# EAGLE design gpio4 (EAGLE 7.2.0)
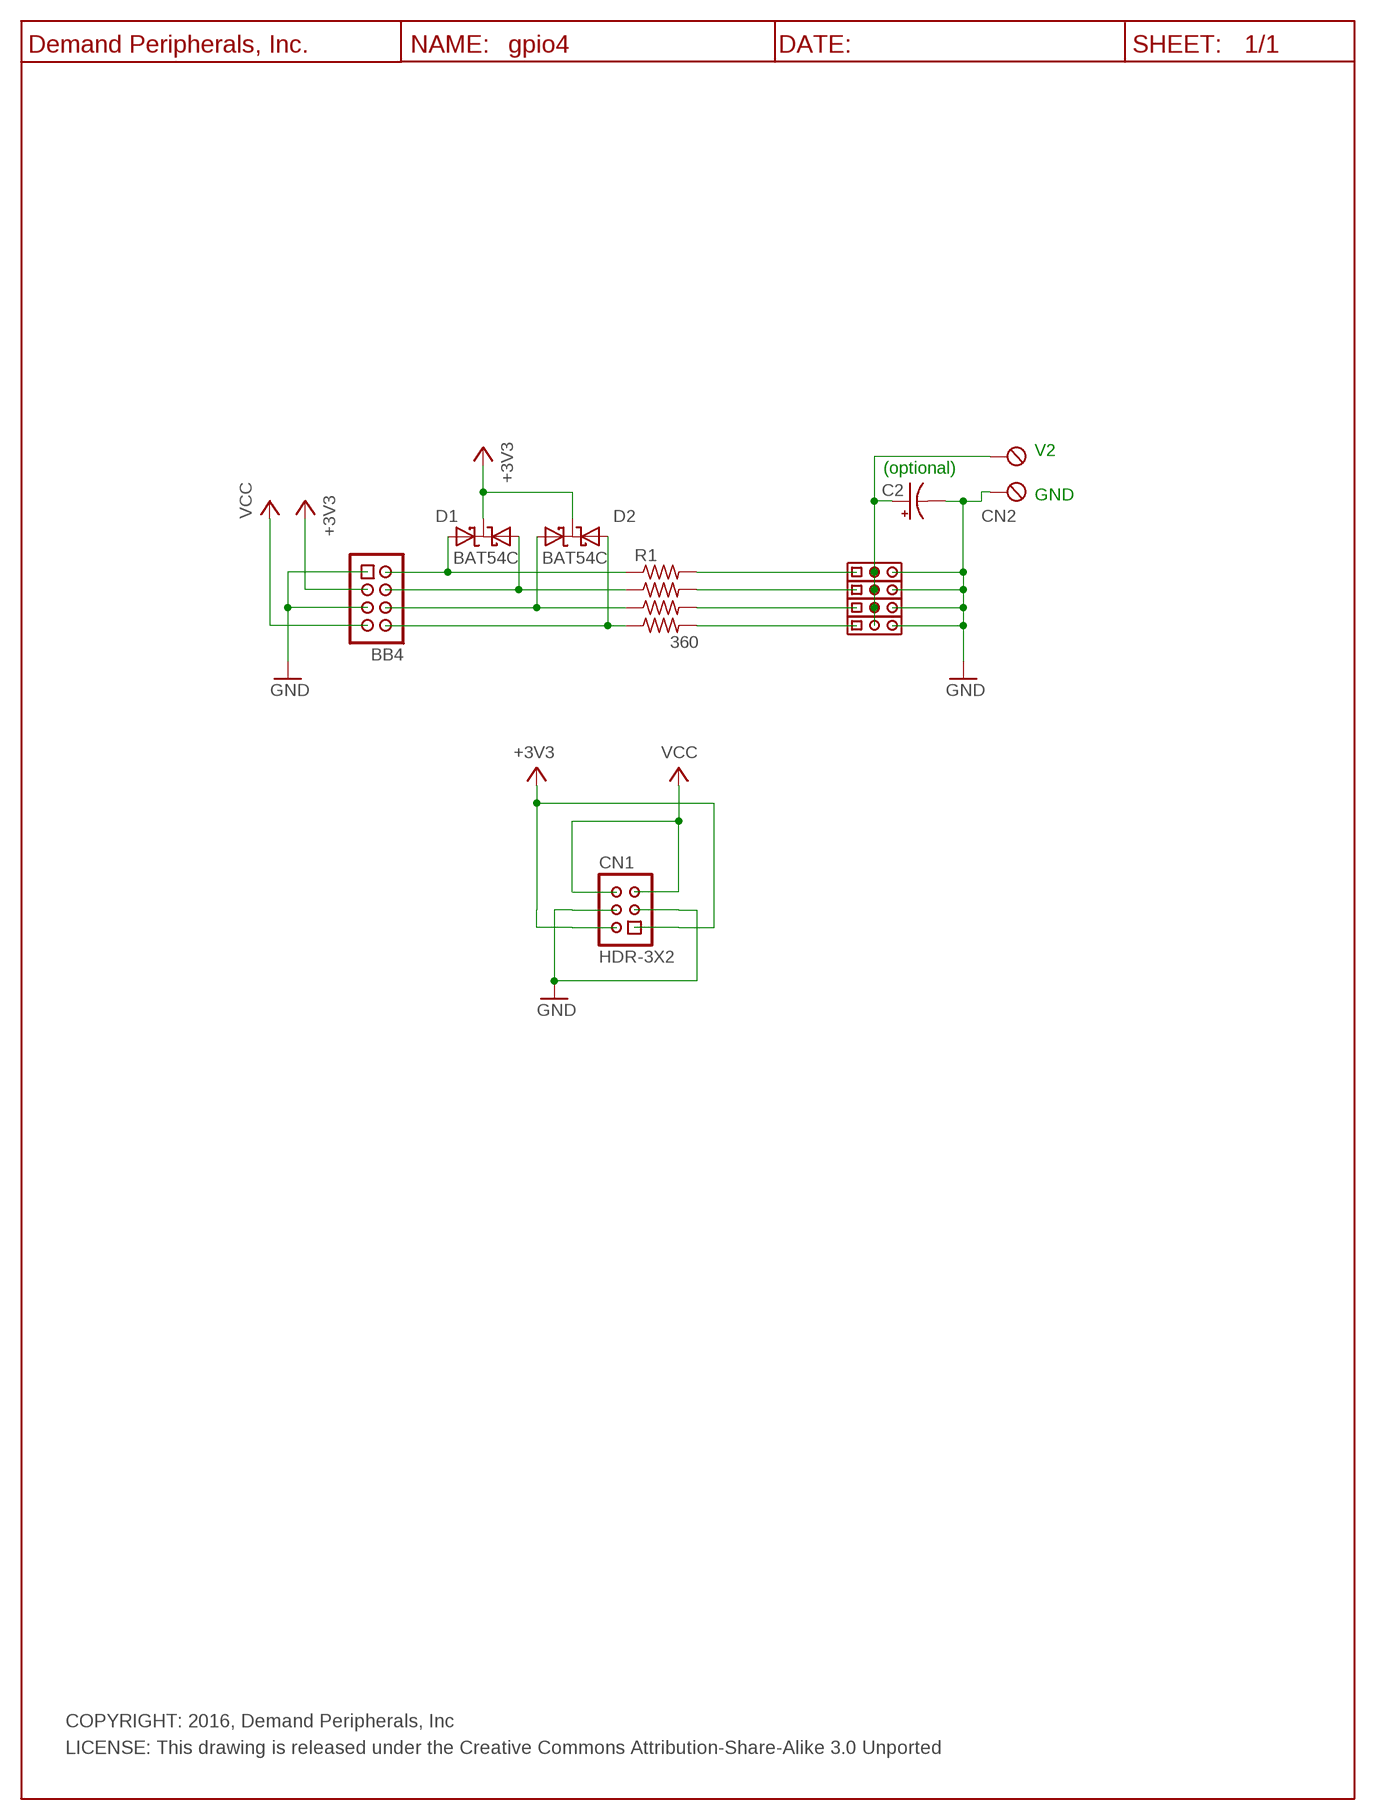
[diagram p0: schematic, sheet 1]

## Parts
BB4  BB_CON  HDR-4X2-SHR  [HDR-4X2]
C2  100uF  C100UF_E3.5-8  [E3.5-8]
CN1  HDR-3X2  [HDR-3X2]
CN2  TBLK-5.08-X2  [TBLK-5.08-X2]
D1  BAT54C  [SOT23]
D2  BAT54C  [SOT23]
R1  360  R360_R0603  [R0603]
R2  360  R360_R0603  [R0603]
R3  360  R360_R0603  [R0603]
R4  360  R360_R0603  [R0603]
U$1  DP_FRAME_P  [P_FRAME]
U$5  HDR-3X1  [HDR-3X1]
U$6  HDR-3X1  [HDR-3X1]
U$7  HDR-3X1  [HDR-3X1]
U$9  HDR-3X1  [HDR-3X1]

## Nets
+3V3: BB4.3 CN1.1 CN1.2 D1.3(CC) D2.3(CC)
GND: BB4.1 BB4.5 C2.- CN1.3 CN1.4 CN2.1(KL) U$5.3 U$6.3 U$7.3 U$9.3
N$1: R1.2 U$5.1
N$2: R2.2 U$6.1
N$3: R3.2 U$7.1
N$4: R4.2 U$9.1
N$11: BB4.2 D1.1(A1) R1.1
N$12: BB4.4 D1.2(A) R2.1
N$14: BB4.6 D2.1(A1) R3.1
N$15: BB4.8 D2.2(A) R4.1
N$18: C2.+ CN2.2(KL1) U$5.2 U$6.2 U$7.2 U$9.2
VCC: BB4.7 CN1.5 CN1.6

## Notes on the sheet
- V2
- (optional)
- GND
- COPYRIGHT: 2016, Demand Peripherals, Inc
- LICENSE: This drawing is released under the Creative Commons Attribution-Share-Alike 3.0 Unported

## Library data of the parts
BB4 = dpi-conn:HDR-4X2-SHR: Shrouded 4x2 pin header; VENDOR: Digikey; VENDOR-PART-NUM: 609-3530-ND
C2 = dpi-passive:C100UF_: 100uF polarized capacitor, general purpose; VENDOR: Digikey; VENDOR-PART-NUM: 1572-1044-ND
CN1 = dpi-conn:HDR-3X2: Unshrouded 3x2 header with 0.1 inch pitch; VENDOR: Digikey; VENDOR-PART-NUM: 952-2120-ND
CN2 = dpi-conn:TBLK-5.08-X2: Terminal Block, 5.08mm, x2, screw terminals; VENDOR: Digikey; VENDOR-PART-NUM: ED2609-ND
D1 D2 = dpi-diopto:BAT54C: BAT54C Dual Common Cathode Schottky; VENDOR: Digikey; VENDOR-PART-NUM: DB3X313N0LCT-ND
R1-R4 = dpi-passive:R360_: 360 Ohm resistor, 1%, 0.1 watt; VENDOR: Digikey; VENDOR-PART-NUM: 311-360HRTR-ND
U$1 = dpi-sym:DP_FRAME_P: Portrait/Letter Document Frame
U$5-U$7 U$9 = dpi-conn:HDR-3X1: 3 pin header on 0.1 inch centers, no shroud, no lock; VENDOR: Digikey; VENDOR-PART-NUM: 952-2264-ND

## Board
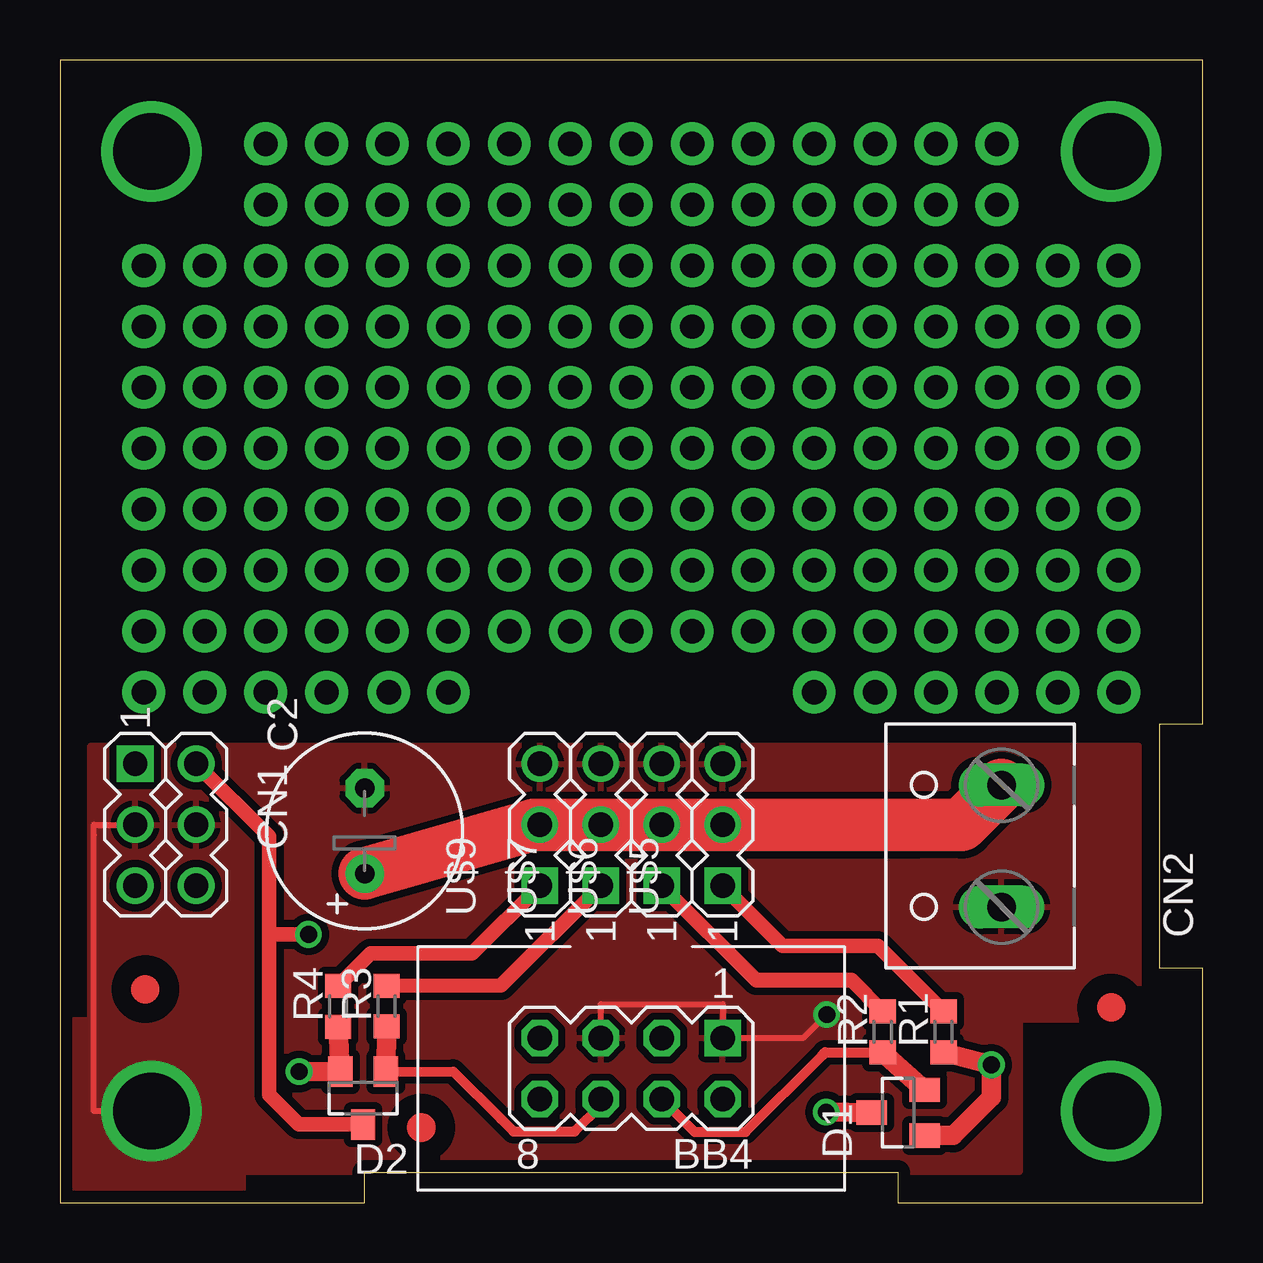
[diagram p1: board, top side]
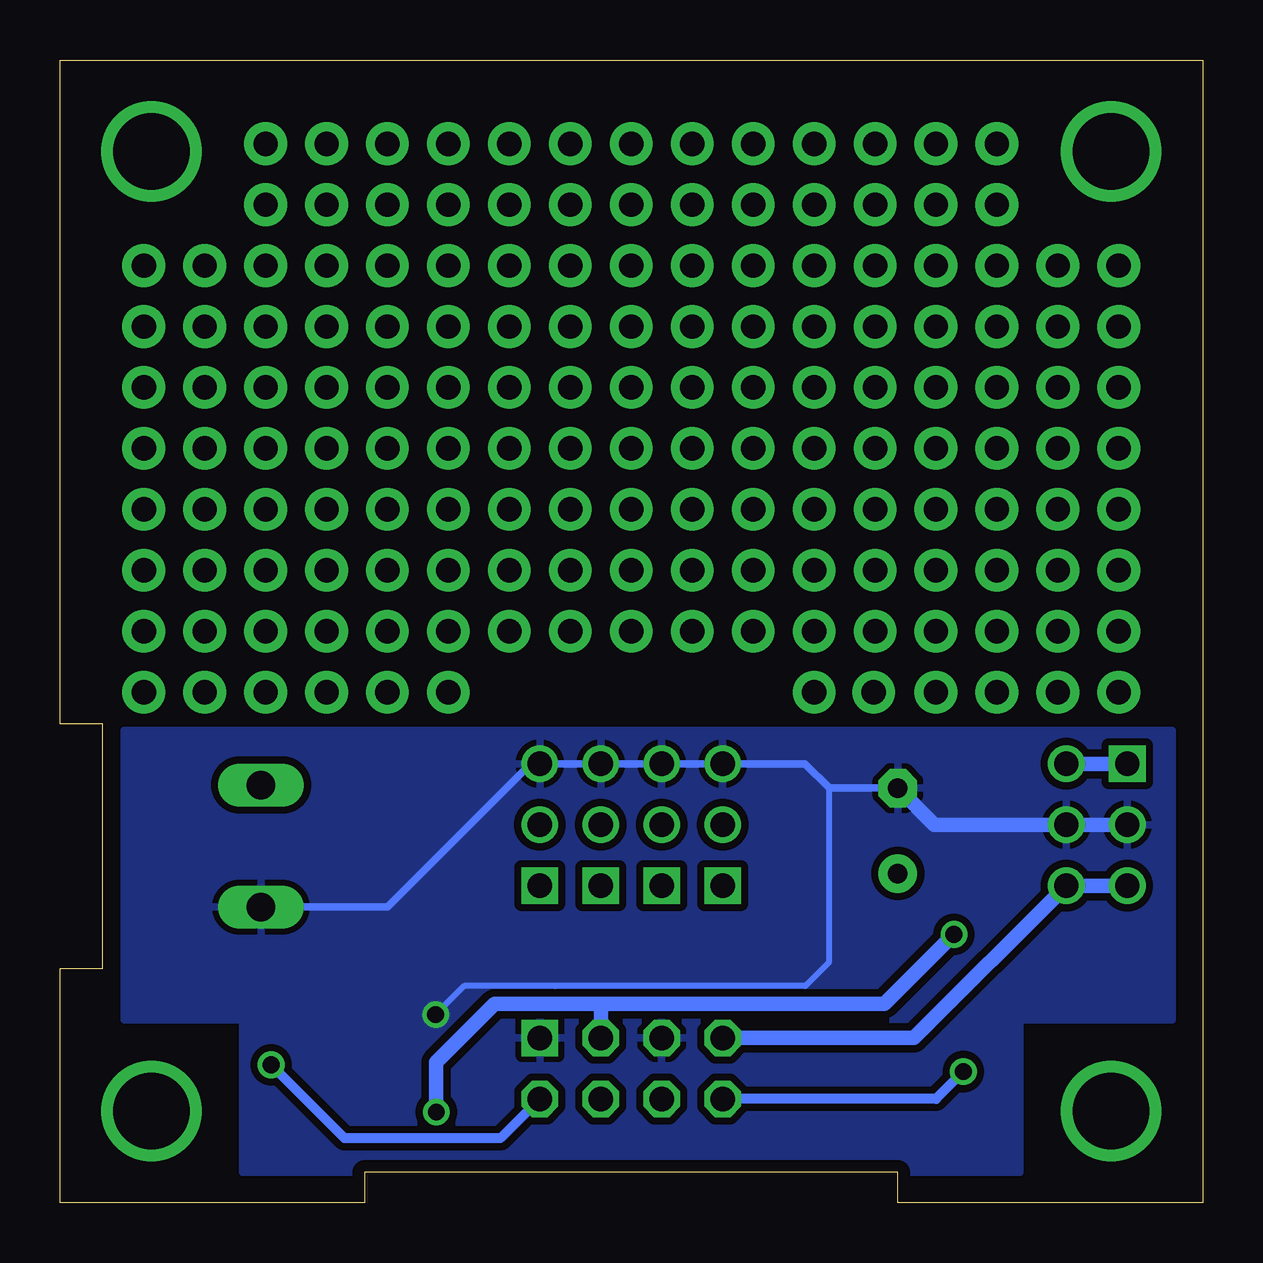
[diagram p2: board, bottom side, seen from below]

Size 47.62 x 47.62 mm. Coordinates in mm from the lower left corner, seen from the top.
Outline: 0,0 12.7,0 12.7,1.27 34.92,1.27 34.92,0 47.62,0 47.62,9.77 45.85,9.77 45.85,19.94 47.62,19.94 47.62,47.62 0,47.62 0,0
Copper layers (1*16): Top 0.035mm / dielectric 1.5mm / Bottom 0.035mm
Design rules "default *": minimum track width 10mil, minimum drill 20mil, track to track 12mil, track to pad 12mil, pad to pad 12mil, via to via 12mil, smd to smd 12mil, copper to edge 20mil, drill to drill 8mil, minimum pad ring 10mil, minimum via ring 8mil, stop-mask expansion 4mil, vias tented up to drill 0mil, thermal gap 10mil
tKeepout: area 15.1,1 to 32.5,9.7

### Footprints (pad centres in the part's own frame; a part is rotated, then mirrored left to right if it is on the bottom)
HDR-4X2 = drill 1.016 square: 1 -3.81,-1.27 | drill 1.016 octagon: 2 -3.81,1.27; 3 -1.27,-1.27; 4 -1.27,1.27; 5 1.27,-1.27; 6 1.27,1.27; 7 3.81,-1.27; 8 3.81,1.27
E3.5-8 = drill 0.813 pad 1.6: + -1.778,0 | drill 0.813 pad 1.6 octagon: - 1.778,0
HDR-3X2 = drill 1.016 square: 1 -2.54,-1.27 | drill 1.016: 2 -2.54,1.27; 3 0,-1.27; 4 0,1.27; 5 2.54,-1.27; 6 2.54,1.27
TBLK-5.08-X2 = drill 1.194 long: 1 -2.54,-0.127; 2 2.54,-0.127
SOT23 = smd 1.016 x 1.27: 1 -0.95,-1.1; 2 0.95,-1.1; 3 0,1.1
R0603 = smd 1 x 1.1: 1 -0.85,0; 2 0.85,0
HDR-3X1 = drill 1.016 square: 1 -2.54,0 | drill 1.016: 2 0,0; 3 2.54,0

### Placement (x,y rotation side)
BB4  23.81,5.59 180 top
C2  12.7,15.49 90 top
CN1  4.41,15.75 270 top
CN2  39.12,14.86 90 top
D1  34.94,3.75 90 top
D2  12.64,4.36 180 top
R1  36.83,7.11 90 top
R2  34.29,7.11 90 top
R3  13.61,8.19 90 top
R4  11.6,8.18 90 top
U$1  -2.54,-2.54 0 top
U$2  [FIDUCIAL]  15.06,3.12 0 top
U$3  [FIDUCIAL]  3.56,8.89 0 top
U$4  [DPI-2]  4.83,9.91 90 bottom
U$5  27.62,15.75 90 top
U$6  25.08,15.75 90 top
U$7  22.54,15.75 90 top
U$8  [FIDUCIAL]  43.81,8.13 0 top
U$9  20,15.75 90 top

### Tracks (layer width: path | path; a pad name or v marks a point on that pad's centre or on a via)
+3V3  (via drill 0.7)
  Top 0.61: D2.3 9.94,3.25 9.63,3.57 8.71,4.48 8.71,5.4 8.71,9.53 8.71,11.18 | 8.71,11.18 8.71,15.25 CN1.2 | 8.71,11.18 v10.36,11.18
  Top 0.813: v31.94,3.77 D1.3
  Bottom 0.61: CN1.2 CN1.1 | 25.34,8.28 13.26,8.28 13.2,8.34 v10.36,11.18 | 25.34,8.28 29.5,8.28 31.94,5.84 v31.94,3.77 | BB4.3 25.08,8.28 25.34,8.28
GND  (via drill 0.7, 3.17)
  Top 0.254: v3.81,3.81 1.41,3.81 1.41,15.3 1.41,15.75 CN1.3 | v31.97,7.84 30.99,6.86 BB4.1 27.64,6.86 27.64,8.27 22.54,8.27 BB4.5
  Bottom 0.254: 15.56,17.27 15.56,10.03 16.56,9.03 26.98,9.03 30.77,9.03 v31.97,7.84
  Bottom 0.305: C2.- 15.56,17.27 16.57,18.29 28,18.29 33.97,12.32 CN2.1
  Bottom 0.61: CN1.3 CN1.4 11.18,15.75 C2.-
  pour Bottom: 1.27,7.62 1.27,19.68 44.96,19.68 44.96,7.62 40.01,7.62 40.01,1.27 7.62,1.27 7.62,7.62
  pour Top: 1.27,19.05 44.96,19.05 44.96,7.62 40.01,7.62 40.01,1.27 7.62,1.27 7.62,0.51 0.51,0.51 0.51,7.62 1.27,7.62
MOUNT2  (via drill 3.17)
  other vias: 43.81,43.81
MOUNT3  (via drill 3.17)
  other vias: 43.81,3.81
MOUNT4  (via drill 3.17)
  other vias: 3.81,43.81
N$1
  Top 0.61: U$5.1 30.12,10.71 34.09,10.71 R1.2
N$2
  Top 0.61: R2.2 32.98,9.27 29.02,9.27 U$6.1 29.03,9.26 32.84,9.26
N$3
  Top 0.61: R3.2 18.38,9.04 U$7.1
N$4
  Top 0.61: R4.2 12.95,10.39 16.18,10.39 17.18,10.39 U$9.1
N$5  (via drill 1.02 pad 1.78)
  other vias: 13.7,21.27
N$6  (via drill 1.02 pad 1.78)
  other vias: 16.19,21.27
N$11  (via drill 0.7)
  Top 0.813: R1.1 v38.82,5.74 38.82,4.38 37.24,2.79 D1.1
  Bottom 0.406: BB4.2 29.26,2.68 35.05,2.68 35.76,2.68 v38.82,5.74
N$12
  Top 0.406: BB4.4 26.45,2.95 28.12,2.95 28.57,2.95 31.75,6.12 31.89,6.26 R2.1
  Top 0.813: R2.1 D1.2
N$14
  Top 0.406: D2.1 16.4,5.46 18.38,3.48 18.9,2.96 21.45,2.96 22.54,4.05 BB4.6
  Top 0.813: D2.1 R3.1
N$15  (via drill 0.7)
  Top 0.813: v9.97,5.46 D2.2 R4.1
  Bottom 0.406: v9.97,5.46 11.11,4.32 BB4.8
N$18
  Top 0.61: 19.75,15.75 U$9.2
  Top 2.184: C2.+ 19.75,15.75 | 19.75,15.75 35.61,15.73 | 35.61,15.73 35.69,15.73 | CN2.2 37.58,15.73 35.61,15.73 | 19.75,15.75 U$9.2 U$7.2 U$6.2 U$5.2
VCC
  Bottom 0.61: CN1.5 CN1.6 12.03,6.86 BB4.7
WW1  (via drill 1.02 pad 1.78)
  other vias: 36.51,23.81
WW2  (via drill 1.02 pad 1.78)
  other vias: 36.51,28.89
WW3  (via drill 1.02 pad 1.78)
  other vias: 3.49,26.35
WW4  (via drill 1.02 pad 1.78)
  other vias: 3.49,23.81
WW5  (via drill 1.02 pad 1.78)
  other vias: 3.49,28.89
WW6  (via drill 1.02 pad 1.78)
  other vias: 3.49,31.43
WW7  (via drill 1.02 pad 1.78)
  other vias: 3.49,33.97
WW8  (via drill 1.02 pad 1.78)
  other vias: 3.49,36.51
WW9  (via drill 1.02 pad 1.78)
  other vias: 3.49,39.05
WW10  (via drill 1.02 pad 1.78)
  other vias: 39.05,23.81
WW11  (via drill 1.02 pad 1.78)
  other vias: 39.05,28.89
WW12  (via drill 1.02 pad 1.78)
  other vias: 3.49,21.27
WW13  (via drill 1.02 pad 1.78)
  other vias: 6.03,26.35
WW14  (via drill 1.02 pad 1.78)
  other vias: 8.57,26.35
WW15  (via drill 1.02 pad 1.78)
  other vias: 11.11,26.35
WW16  (via drill 1.02 pad 1.78)
  other vias: 6.03,23.81
WW17  (via drill 1.02 pad 1.78)
  other vias: 6.03,28.89
WW18  (via drill 1.02 pad 1.78)
  other vias: 6.03,31.43
WW19  (via drill 1.02 pad 1.78)
  other vias: 6.03,33.97
WW20  (via drill 1.02 pad 1.78)
  other vias: 6.03,36.51
WW21  (via drill 1.02 pad 1.78)
  other vias: 6.03,39.05
WW22  (via drill 1.02 pad 1.78)
  other vias: 41.59,23.81
WW23  (via drill 1.02 pad 1.78)
  other vias: 41.59,28.89
WW24  (via drill 1.02 pad 1.78)
  other vias: 13.65,26.35
WW25  (via drill 1.02 pad 1.78)
  other vias: 16.19,26.35
WW26  (via drill 1.02 pad 1.78)
  other vias: 18.73,26.35
WW27  (via drill 1.02 pad 1.78)
  other vias: 21.27,26.35
WW28  (via drill 1.02 pad 1.78)
  other vias: 8.57,23.81
WW29  (via drill 1.02 pad 1.78)
  other vias: 8.57,28.89
WW30  (via drill 1.02 pad 1.78)
  other vias: 8.57,31.43
WW31  (via drill 1.02 pad 1.78)
  other vias: 8.57,33.97
WW32  (via drill 1.02 pad 1.78)
  other vias: 8.57,36.51
WW33  (via drill 1.02 pad 1.78)
  other vias: 8.57,39.05
WW34  (via drill 1.02 pad 1.78)
  other vias: 8.57,41.59
WW35  (via drill 1.02 pad 1.78)
  other vias: 8.57,44.13
WW36  (via drill 1.02 pad 1.78)
  other vias: 44.13,23.81
WW37  (via drill 1.02 pad 1.78)
  other vias: 23.81,26.35
WW38  (via drill 1.02 pad 1.78)
  other vias: 26.35,26.35
WW39  (via drill 1.02 pad 1.78)
  other vias: 28.89,26.35
WW40  (via drill 1.02 pad 1.78)
  other vias: 11.11,23.81
WW41  (via drill 1.02 pad 1.78)
  other vias: 11.11,28.89
WW42  (via drill 1.02 pad 1.78)
  other vias: 11.11,31.43
WW43  (via drill 1.02 pad 1.78)
  other vias: 11.11,33.97
WW44  (via drill 1.02 pad 1.78)
  other vias: 11.11,36.51
WW45  (via drill 1.02 pad 1.78)
  other vias: 11.11,39.05
WW46  (via drill 1.02 pad 1.78)
  other vias: 11.11,41.59
WW47  (via drill 1.02 pad 1.78)
  other vias: 11.11,44.13
WW48  (via drill 1.02 pad 1.78)
  other vias: 44.13,28.89
WW49  (via drill 1.02 pad 1.78)
  other vias: 31.43,26.35
WW50  (via drill 1.02 pad 1.78)
  other vias: 6.03,21.27
WW51  (via drill 1.02 pad 1.78)
  other vias: 33.97,26.35
WW52  (via drill 1.02 pad 1.78)
  other vias: 13.65,23.81
WW53  (via drill 1.02 pad 1.78)
  other vias: 13.65,28.89
WW54  (via drill 1.02 pad 1.78)
  other vias: 13.65,31.43
WW55  (via drill 1.02 pad 1.78)
  other vias: 13.65,33.97
WW56  (via drill 1.02 pad 1.78)
  other vias: 13.65,36.51
WW57  (via drill 1.02 pad 1.78)
  other vias: 13.65,39.05
WW58  (via drill 1.02 pad 1.78)
  other vias: 13.65,41.59
WW59  (via drill 1.02 pad 1.78)
  other vias: 13.65,44.13
WW60  (via drill 1.02 pad 1.78)
  other vias: 36.51,26.35
WW61  (via drill 1.02 pad 1.78)
  other vias: 8.57,21.27
WW62  (via drill 1.02 pad 1.78)
  other vias: 39.05,26.35
WW63  (via drill 1.02 pad 1.78)
  other vias: 41.59,26.35
WW64  (via drill 1.02 pad 1.78)
  other vias: 16.19,23.81
WW65  (via drill 1.02 pad 1.78)
  other vias: 16.19,28.89
WW66  (via drill 1.02 pad 1.78)
  other vias: 16.19,31.43
WW67  (via drill 1.02 pad 1.78)
  other vias: 16.19,33.97
WW68  (via drill 1.02 pad 1.78)
  other vias: 16.19,36.51
WW69  (via drill 1.02 pad 1.78)
  other vias: 16.19,39.05
WW70  (via drill 1.02 pad 1.78)
  other vias: 16.19,41.59
WW71  (via drill 1.02 pad 1.78)
  other vias: 16.19,44.13
WW72  (via drill 1.02 pad 1.78)
  other vias: 11.11,21.27
WW73  (via drill 1.02 pad 1.78)
  other vias: 44.13,26.35
WW76  (via drill 1.02 pad 1.78)
  other vias: 18.73,23.81
WW77  (via drill 1.02 pad 1.78)
  other vias: 18.73,28.89
WW78  (via drill 1.02 pad 1.78)
  other vias: 18.73,31.43
WW79  (via drill 1.02 pad 1.78)
  other vias: 18.73,33.97
WW80  (via drill 1.02 pad 1.78)
  other vias: 18.73,36.51
WW81  (via drill 1.02 pad 1.78)
  other vias: 18.73,39.05
WW82  (via drill 1.02 pad 1.78)
  other vias: 18.73,41.59
WW83  (via drill 1.02 pad 1.78)
  other vias: 18.73,44.13
WW88  (via drill 1.02 pad 1.78)
  other vias: 21.27,23.81
WW89  (via drill 1.02 pad 1.78)
  other vias: 21.27,28.89
WW90  (via drill 1.02 pad 1.78)
  other vias: 21.27,31.43
WW91  (via drill 1.02 pad 1.78)
  other vias: 21.27,33.97
WW92  (via drill 1.02 pad 1.78)
  other vias: 21.27,36.51
WW93  (via drill 1.02 pad 1.78)
  other vias: 21.27,39.05
WW94  (via drill 1.02 pad 1.78)
  other vias: 21.27,41.59
WW95  (via drill 1.02 pad 1.78)
  other vias: 21.27,44.13
WW100  (via drill 1.02 pad 1.78)
  other vias: 23.81,23.81
WW101  (via drill 1.02 pad 1.78)
  other vias: 23.81,28.89
WW102  (via drill 1.02 pad 1.78)
  other vias: 23.81,31.43
WW103  (via drill 1.02 pad 1.78)
  other vias: 23.81,33.97
WW104  (via drill 1.02 pad 1.78)
  other vias: 23.81,36.51
WW105  (via drill 1.02 pad 1.78)
  other vias: 23.81,39.05
WW106  (via drill 1.02 pad 1.78)
  other vias: 23.81,41.59
WW107  (via drill 1.02 pad 1.78)
  other vias: 23.81,44.13
WW112  (via drill 1.02 pad 1.78)
  other vias: 26.35,23.81
WW113  (via drill 1.02 pad 1.78)
  other vias: 26.35,28.89
WW114  (via drill 1.02 pad 1.78)
  other vias: 26.35,31.43
WW115  (via drill 1.02 pad 1.78)
  other vias: 26.35,33.97
WW116  (via drill 1.02 pad 1.78)
  other vias: 26.35,36.51
WW117  (via drill 1.02 pad 1.78)
  other vias: 26.35,39.05
WW118  (via drill 1.02 pad 1.78)
  other vias: 26.35,41.59
WW119  (via drill 1.02 pad 1.78)
  other vias: 26.35,44.13
WW124  (via drill 1.02 pad 1.78)
  other vias: 28.89,23.81
WW125  (via drill 1.02 pad 1.78)
  other vias: 28.89,28.89
WW126  (via drill 1.02 pad 1.78)
  other vias: 28.89,31.43
WW127  (via drill 1.02 pad 1.78)
  other vias: 28.89,33.97
WW128  (via drill 1.02 pad 1.78)
  other vias: 28.89,36.51
WW129  (via drill 1.02 pad 1.78)
  other vias: 28.89,39.05
WW130  (via drill 1.02 pad 1.78)
  other vias: 28.89,41.59
WW131  (via drill 1.02 pad 1.78)
  other vias: 28.89,44.13
WW136  (via drill 1.02 pad 1.78)
  other vias: 31.43,23.81
WW137  (via drill 1.02 pad 1.78)
  other vias: 31.43,28.89
WW138  (via drill 1.02 pad 1.78)
  other vias: 31.43,31.43
WW139  (via drill 1.02 pad 1.78)
  other vias: 31.43,33.97
WW140  (via drill 1.02 pad 1.78)
  other vias: 31.43,36.51
WW141  (via drill 1.02 pad 1.78)
  other vias: 31.43,39.05
WW142  (via drill 1.02 pad 1.78)
  other vias: 31.43,41.59
WW143  (via drill 1.02 pad 1.78)
  other vias: 31.43,44.13
WW144  (via drill 1.02 pad 1.78)
  other vias: 31.43,21.27
WW147  (via drill 1.02 pad 1.78)
  other vias: 33.97,21.27
WW148  (via drill 1.02 pad 1.78)
  other vias: 33.97,23.81
WW149  (via drill 1.02 pad 1.78)
  other vias: 33.97,28.89
WW150  (via drill 1.02 pad 1.78)
  other vias: 33.97,31.43
WW151  (via drill 1.02 pad 1.78)
  other vias: 33.97,33.97
WW152  (via drill 1.02 pad 1.78)
  other vias: 33.97,36.51
WW153  (via drill 1.02 pad 1.78)
  other vias: 33.97,39.05
WW154  (via drill 1.02 pad 1.78)
  other vias: 33.97,41.59
WW155  (via drill 1.02 pad 1.78)
  other vias: 33.97,44.13
WW162  (via drill 1.02 pad 1.78)
  other vias: 36.51,31.43
WW163  (via drill 1.02 pad 1.78)
  other vias: 36.51,33.97
WW164  (via drill 1.02 pad 1.78)
  other vias: 36.51,36.51
WW165  (via drill 1.02 pad 1.78)
  other vias: 36.51,39.05
WW166  (via drill 1.02 pad 1.78)
  other vias: 36.51,41.59
WW167  (via drill 1.02 pad 1.78)
  other vias: 36.51,44.13
WW168  (via drill 1.02 pad 1.78)
  other vias: 36.51,21.27
WW170  (via drill 1.02 pad 1.78)
  other vias: 39.05,21.27
WW172  (via drill 1.02 pad 1.78)
  other vias: 41.59,21.27
WW174  (via drill 1.02 pad 1.78)
  other vias: 39.05,31.43
WW175  (via drill 1.02 pad 1.78)
  other vias: 39.05,33.97
WW176  (via drill 1.02 pad 1.78)
  other vias: 39.05,36.51
WW177  (via drill 1.02 pad 1.78)
  other vias: 39.05,39.05
WW178  (via drill 1.02 pad 1.78)
  other vias: 39.05,41.59
WW179  (via drill 1.02 pad 1.78)
  other vias: 39.05,44.13
WW180  (via drill 1.02 pad 1.78)
  other vias: 44.13,21.27
WW186  (via drill 1.02 pad 1.78)
  other vias: 41.59,31.43
WW187  (via drill 1.02 pad 1.78)
  other vias: 41.59,33.97
WW188  (via drill 1.02 pad 1.78)
  other vias: 41.59,36.51
WW189  (via drill 1.02 pad 1.78)
  other vias: 41.59,39.05
WW198  (via drill 1.02 pad 1.78)
  other vias: 44.13,31.43
WW199  (via drill 1.02 pad 1.78)
  other vias: 44.13,33.97
WW200  (via drill 1.02 pad 1.78)
  other vias: 44.13,36.51
WW201  (via drill 1.02 pad 1.78)
  other vias: 44.13,39.05

### Text on the board
tTest: 1.875 Inches | 1.575 Inches | (C) 2017, Demand Peripherals, Inc. | GPIO4, Rev 17A | 4 | 3 | 2 | 1 | 3 | G | V2 | 1.575 Inches | 1.875 Inches | 5 | C1 | + | R3 | BB4 | Gnd | R2 | R4 | R1 | D2 | D1